# Altium schematic sheet Charger TopLevel.SchDoc
size A3; SheetNumber: 1; SheetTotal: 1; SPICEModelCacheXVHMCBVE: <root> / <DocumentId>XVHMCBVE</DocumentId> / <CacheFrame Number="0"> / <Model Name="dpstrelay" Kind="CKT"> / <Text>*DPST Relay Subcircuit Parameters / *PULLIN     = Pull in voltage / *DROPOFF    = Drop off voltage / *CONTACT    = Contact resistance / *RESISTANCE = Coil resistance / *INDUCTANCE = Coil Inductance / * jjt 15/6/2002: changed DPDT model to DPST. / * / *Generic DPST Relay / *Connections:     NO_A1 / *                 | NO_A2 / *                 | | NO_B1 / *                 | | | NO_B2 / *                 | | | |  T1 / *                 | | | |  | T2 / *                 | | | |  | | / *                 | | | |  | | / *                 | | | |  | | / *                 | | | |  | | / .SUBCKT DPSTRELAY 1 2 3 10 4 5 / + PARAMS: PULLIN=4 DROPOFF=0.1 CONTACT=1m RESISTANCE=500 INDUCTANCE=10m / L1 4 6 {(INDUCTANCE/2)} / L2 5 7 {(INDUCTANCE/2)} / R1 6 7 {RESISTANCE} / * / BNO1 8 0 V={PULLIN}-abs(v(6,7)) / SW1 1 2 8 0 SWNO OFF / * / BNO2 9 0 V={PULLIN}-abs(v(6,7)) / SW2 3 10 9 0 SWNO OFF / * / .MODEL SWNO SW(VT={(PULLIN*0.98)} RON={CONTACT} ) / .ENDS DPSTRELAY</Text> / </Model> / <Model Name="spstrelay" Kind="CKT"> / <Text>*SPST Relay Subcircuit Parameters / *PULLIN     = Pull in voltage / *DROPOFF    = Drop off voltage / *CONTACT    = Contact resistance / *RESISTANCE = Coil resistance / *INDUCTANCE = Coil Inductance / * jjt 15/6/2002: changed DPST model to SPST. / * / *Generic DPST Relay / *Connections:     NO_A1 / *                 | NO_A2 / *                 | | T1 / *                 | | | T2 / *                 | | | | / *                 | | | | / *                 | | | | / *                 | | | | / .SUBCKT SPSTRELAY 1 2 4 5 / + PARAMS: PULLIN=4 DROPOFF=0.1 CONTACT=1m RESISTANCE=500 INDUCTANCE=10m / L1 4 6 {(INDUCTANCE/2)} / L2 5 7 {(INDUCTANCE/2)} / R1 6 7 {RESISTANCE} / * / BNO1 8 0 V={PULLIN}-abs(v(6,7)) / SW1 1 2 8 0 SWNO OFF / * / .MODEL SWNO SW(VT={(PULLIN*0.98)} RON={CONTACT} ) / .ENDS SPSTRELAY</Text> / </Model> / <Model Name="fuse" Kind="CKT"> / <Text>.SUBCKT FUSE 1 2 PARAMS: CURRENT=1 RESISTANCE=1m / SW1 1 2 3 0 SMOD OFF / BNLV 3 0 V=(abs(v(1,2))) / .MODEL SMOD SW (VT={(CURRENT*RESISTANCE)} RON=1g ROFF={RESISTANCE}) / .ENDS FUSE</Text> / </Model> / </CacheFrame> / </root>
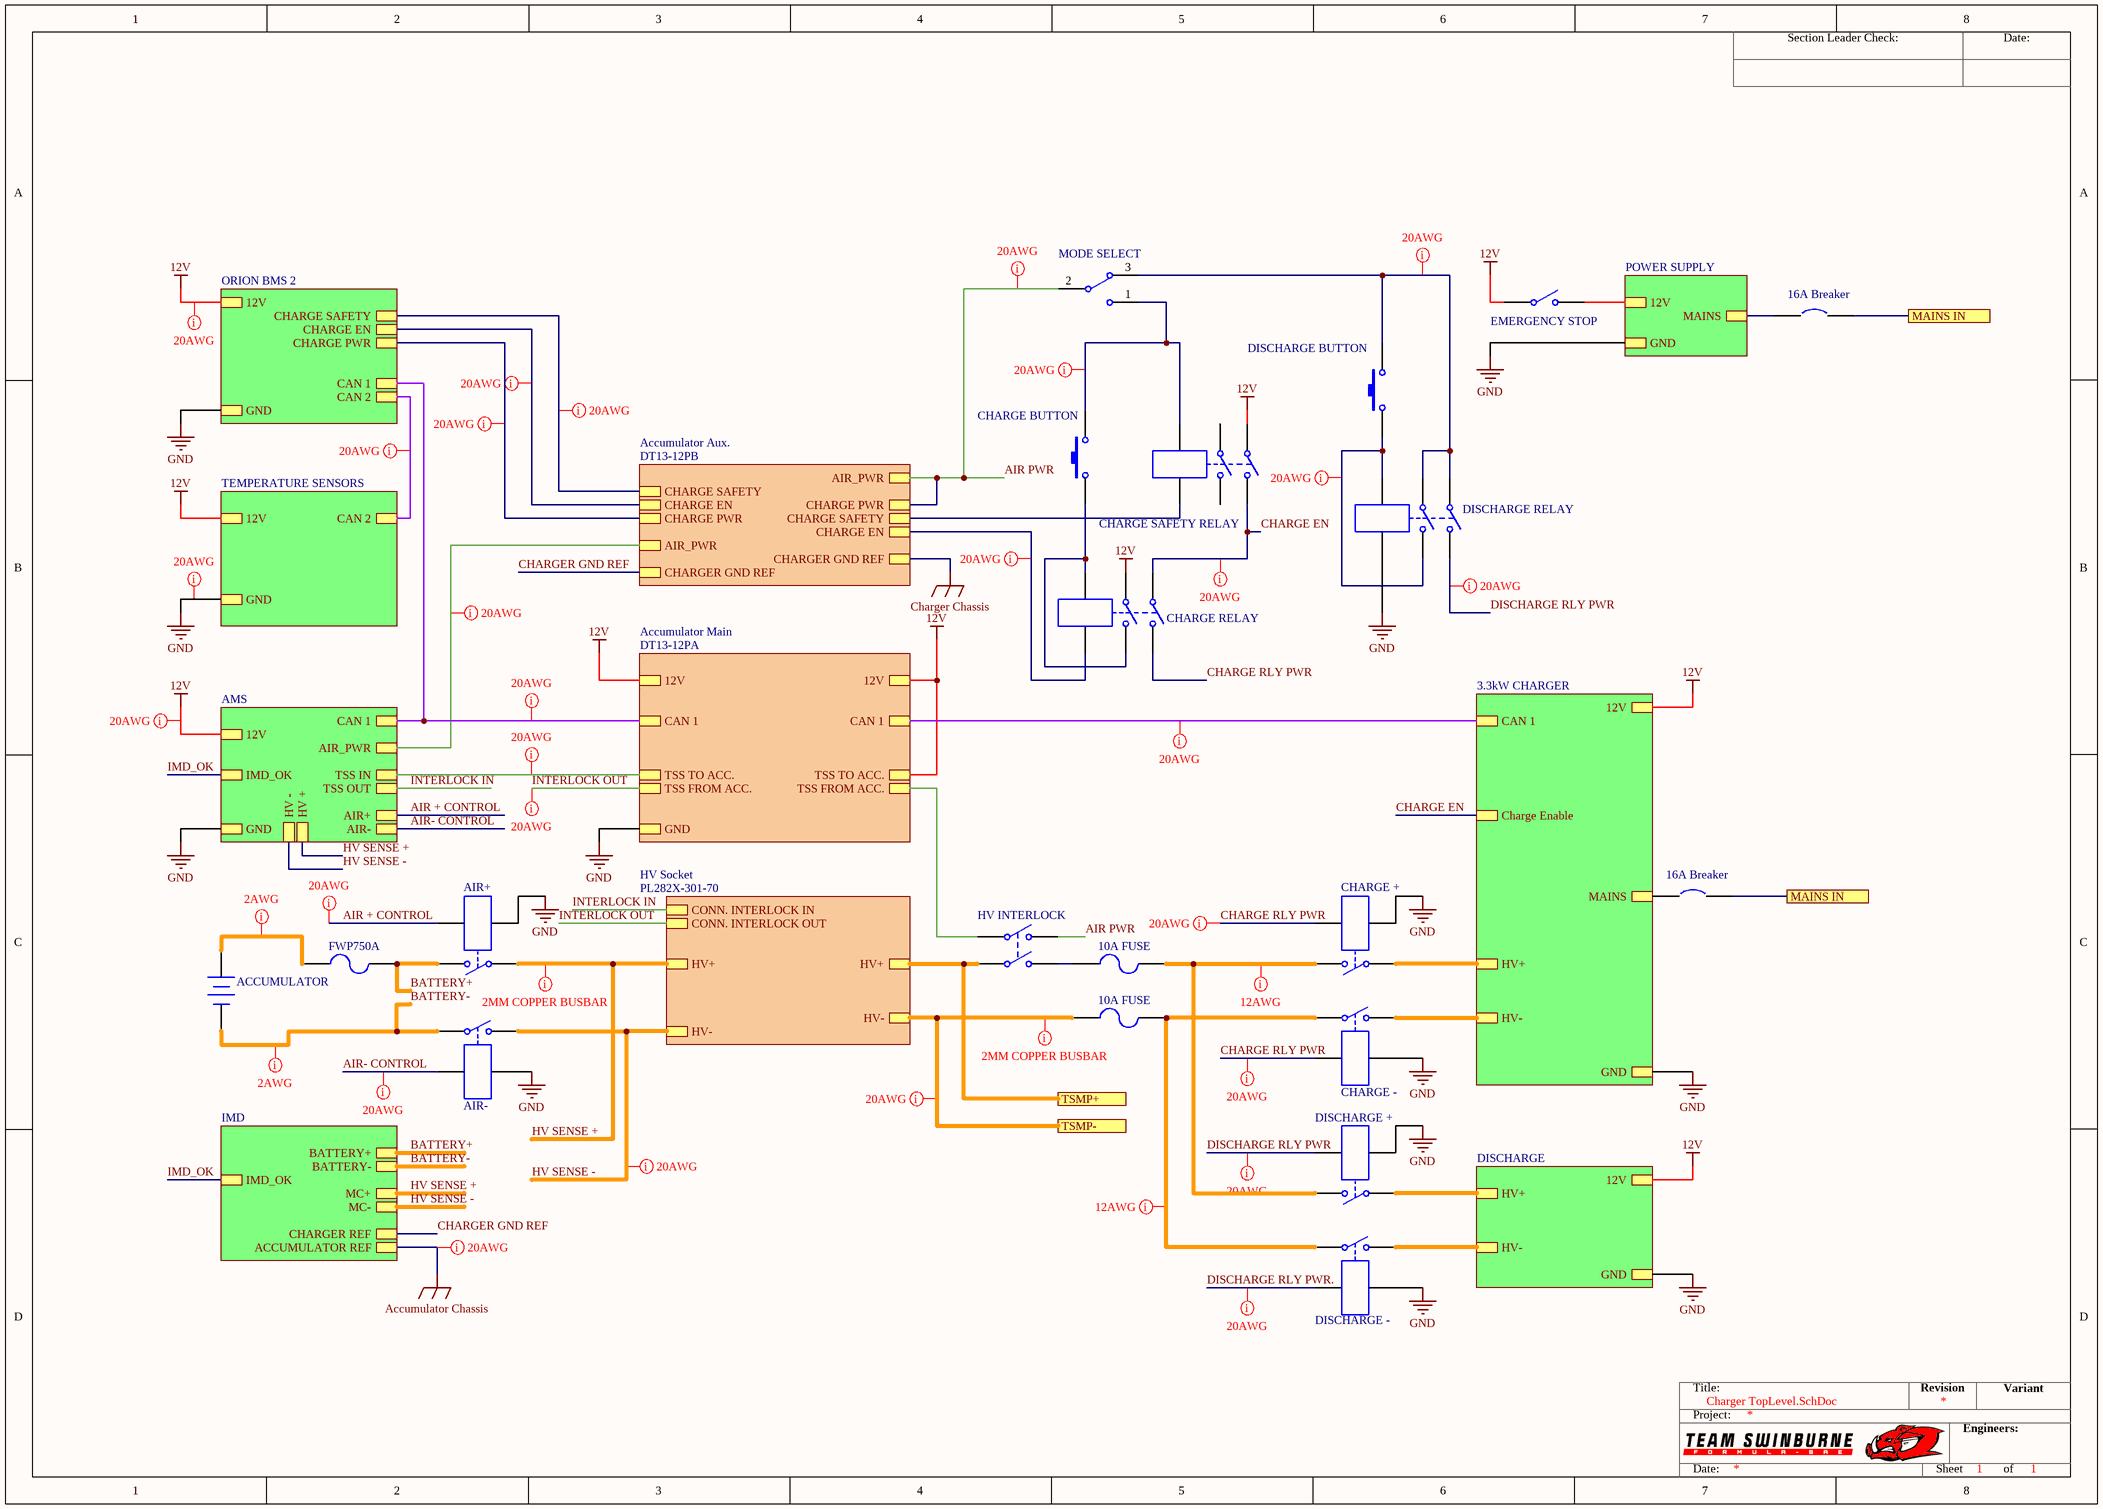
[diagram p0: Charger TopLevel.SchDoc]

## Parts
(Parts that share a designator on the sheet are numbered #1, #2 ... from top to bottom, then left to right.)
10A_FUSE#1  Fuse 2  [PIN-W2/E2.8]  (value not drawn)
10A_FUSE#2  Fuse 2  [PIN-W2/E2.8]  (value not drawn)
16A_Breaker#1  Circuit Breaker  [SPST-2]  (value not drawn)
16A_Breaker#2  Circuit Breaker  [SPST-2]  (value not drawn)
ACCUMULATOR  Battery  [BAT-2]  (value not drawn)
AIR+  Relay-SPST  [MODULE4]  (value not drawn)
AIR-  AIR-  [MODULE4]
CHARGE_+  Relay-SPST  [MODULE4]  (value not drawn)
CHARGE_BUTTON  SW-PB  [SPST-2]  (value not drawn)
CHARGE_RELAY  Relay-DPST  [MODULE6]  (value not drawn)
CHARGE_SAFETY_RELAY  Relay-DPST  [MODULE6]  (value not drawn)
DISCHARGE_+  Relay-SPST  [MODULE4]  (value not drawn)
DISCHARGE_BUTTON  SW-PB  [SPST-2]  (value not drawn)
DISCHARGE_RELAY  Relay-DPST  [MODULE6]  (value not drawn)
EMERGENCY_STOP  SW-SPST  [SPST-2]  (value not drawn)
FWP750A  Fuse 2  [PIN-W2/E2.8]  (value not drawn)
HV_INTERLOCK  SW-DPST  [DPST-4]  (value not drawn)
K?#1  CHARGE -  [MODULE4]
K?#2  DISCHARGE -  [MODULE4]
MODE_SELECT  (no value)  [TL36WW15050]

## Sub-sheets
3.3kW CHARGER = File Name: CAN 1, GND, 12V, HV+, HV-, MAINS, Charge Enable
Accumulator Aux. = DT13-12PB: CHARGE SAFETY, CHARGE EN, CHARGE PWR, AIR_PWR, AIR_PWR, CHARGE SAFETY, CHARGE EN, CHARGE PWR, CHARGER GND REF, CHARGER GND REF
Accumulator Main = DT13-12PA: 12V, GND, CAN 1, TSS TO ACC., TSS FROM ACC., TSS TO ACC., TSS FROM ACC., 12V, CAN 1
AMS = File Name: CAN 1, GND, 12V, HV +, HV -, TSS IN, TSS OUT, AIR_PWR, AIR+, AIR-, IMD_OK
DISCHARGE = File Name: HV+, GND, 12V, HV-
HV Socket = PL282X-301-70: HV+, HV-, HV+, HV-, CONN. INTERLOCK IN, CONN. INTERLOCK OUT
IMD = File Name: BATTERY+, BATTERY-, IMD_OK, CHARGER REF, ACCUMULATOR REF, MC+, MC-
ORION BMS 2 = File Name: 12V, GND, CHARGE PWR, CHARGE SAFETY, CHARGE EN, CAN 1, CAN 2
POWER SUPPLY = File Name: 12V, GND, MAINS
TEMPERATURE SENSORS = File Name: CAN 2, GND, 12V

## Ports
MAINS IN, TSMP+, TSMP-

## Nets
12V: CHARGE_RELAY.3 CHARGE_SAFETY_RELAY.1 EMERGENCY_STOP.1(COMMON) ; sheet ORION BMS 2/12V, sheet TEMPERATURE SENSORS/12V, sheet AMS/12V, sheet Accumulator Main/12V, sheet Accumulator Main/TSS TO ACC., sheet Accumulator Main/12V, sheet 3.3kW CHARGER/12V, sheet DISCHARGE/12V
Accumulator Chassis: sheet IMD/ACCUMULATOR REF
Charger Chassis: sheet Accumulator Aux./CHARGER GND REF
GND: AIR+.3 AIR-.4 CHARGE_+.3 DISCHARGE_+.3 DISCHARGE_RELAY.6 K?#1.4 K?#2.4 ; sheet ORION BMS 2/GND, sheet TEMPERATURE SENSORS/GND, sheet AMS/GND, sheet Accumulator Main/GND, sheet POWER SUPPLY/GND, sheet 3.3kW CHARGER/GND, sheet DISCHARGE/GND
AIR + CONTROL: AIR+.4 ; sheet AMS/AIR+
AIR PWR: HV_INTERLOCK.2(NO1) MODE_SELECT.2 ; sheet Accumulator Aux./AIR_PWR, sheet Accumulator Aux./CHARGE PWR
AIR- CONTROL: AIR-.3 ; sheet AMS/AIR-
BATTERY+: AIR+.2 FWP750A.2 ; sheet IMD/BATTERY+
BATTERY-: ACCUMULATOR.2(-) AIR-.1 ; sheet IMD/BATTERY-
CHARGE EN: CHARGE_RELAY.1 CHARGE_SAFETY_RELAY.2 ; sheet 3.3kW CHARGER/Charge Enable
CHARGE RLY PWR: CHARGE_+.4 CHARGE_RELAY.2 K?#1.3
CHARGER GND REF: sheet Accumulator Aux./CHARGER GND REF, sheet IMD/CHARGER REF
DISCHARGE RLY PWR: DISCHARGE_+.4 DISCHARGE_RELAY.2
DISCHARGE RLY PWR.: K?#2.3
HV SENSE +: AIR+.1 ; sheet AMS/HV +, sheet HV Socket/HV+, sheet IMD/MC+
HV SENSE -: AIR-.2 ; sheet AMS/HV -, sheet HV Socket/HV-, sheet IMD/MC-
IMD_OK: sheet AMS/IMD_OK, sheet IMD/IMD_OK
INTERLOCK IN: sheet AMS/TSS OUT, sheet HV Socket/CONN. INTERLOCK IN
INTERLOCK OUT: sheet Accumulator Main/TSS FROM ACC., sheet HV Socket/CONN. INTERLOCK OUT
MAINS IN: 16A_Breaker#1.2 16A_Breaker#2.2 ; port MAINS IN
TSMP+: HV_INTERLOCK.3(COMMON2) ; port TSMP+, sheet HV Socket/HV+
TSMP-: 10A_FUSE#2.1 ; port TSMP-, sheet HV Socket/HV-
Net10A_FUSE#1_1: 10A_FUSE#1.1 HV_INTERLOCK.4(NO2)
Net10A_FUSE#1_2: 10A_FUSE#1.2 CHARGE_+.2 DISCHARGE_+.2
Net10A_FUSE#2_2: 10A_FUSE#2.2 K?#1.1 K?#2.1
Net16A_Breaker#1_1: 16A_Breaker#1.1 ; sheet POWER SUPPLY/MAINS
Net16A_Breaker#2_1: 16A_Breaker#2.1 ; sheet 3.3kW CHARGER/MAINS
NetACCUMULATOR_1: ACCUMULATOR.1(+) FWP750A.1
NetCHARGE_+_1: CHARGE_+.1 ; sheet 3.3kW CHARGER/HV+
NetCHARGE_BUTTON_1: CHARGE_BUTTON.1 CHARGE_RELAY.4 CHARGE_RELAY.5
NetCHARGE_BUTTON_2: CHARGE_BUTTON.2 CHARGE_SAFETY_RELAY.5 MODE_SELECT.1
NetCHARGE_RELAY_6: CHARGE_RELAY.6 ; sheet Accumulator Aux./CHARGE EN
NetCHARGE_SAFETY_RELAY_6: CHARGE_SAFETY_RELAY.6 ; sheet Accumulator Aux./CHARGE SAFETY
NetDISCHARGE_+_1: DISCHARGE_+.1 ; sheet DISCHARGE/HV+
NetDISCHARGE_BUTTON_1: DISCHARGE_BUTTON.1 DISCHARGE_RELAY.4 DISCHARGE_RELAY.5
NetDISCHARGE_BUTTON_2: DISCHARGE_BUTTON.2 DISCHARGE_RELAY.1 DISCHARGE_RELAY.3 MODE_SELECT.3
NetEMERGENCY_STOP_2: EMERGENCY_STOP.2(NO) ; sheet POWER SUPPLY/12V
NetHV_INTERLOCK_1: HV_INTERLOCK.1(COMMON1) ; sheet Accumulator Main/TSS FROM ACC.
NetK?#1_2: K?#1.2 ; sheet 3.3kW CHARGER/HV-
NetK?#2_2: K?#2.2 ; sheet DISCHARGE/HV-
(unnamed): sheet ORION BMS 2/CHARGE PWR, sheet Accumulator Aux./CHARGE PWR
(unnamed): sheet ORION BMS 2/CHARGE SAFETY, sheet Accumulator Aux./CHARGE SAFETY
(unnamed): sheet ORION BMS 2/CHARGE EN, sheet Accumulator Aux./CHARGE EN
(unnamed): sheet ORION BMS 2/CAN 1, sheet AMS/CAN 1, sheet Accumulator Main/CAN 1
(unnamed): sheet ORION BMS 2/CAN 2, sheet TEMPERATURE SENSORS/CAN 2
(unnamed): sheet AMS/TSS IN, sheet Accumulator Main/TSS TO ACC.
(unnamed): sheet AMS/AIR_PWR, sheet Accumulator Aux./AIR_PWR
(unnamed): sheet Accumulator Main/CAN 1, sheet 3.3kW CHARGER/CAN 1

Not connected (* = marked no-connect by the designer): CHARGE_SAFETY_RELAY 3 4

## Layout directives
mark named 20AWG: 12V, (no net found under the mark), Accumulator Chassis, AIR + CONTROL, AIR PWR, AIR- CONTROL, CHARGE EN, CHARGE RLY PWR, DISCHARGE RLY PWR, DISCHARGE RLY PWR., GND, HV SENSE -, INTERLOCK OUT, NetCHARGE_BUTTON_2, NetCHARGE_RELAY_6, NetDISCHARGE_BUTTON_1, NetDISCHARGE_BUTTON_2, TSMP-
mark named 12AWG: Net10A_FUSE#1_2, Net10A_FUSE#2_2
mark named 2MM COPPER BUSBAR: HV SENSE +, TSMP-
mark named 2AWG: BATTERY-, NetACCUMULATOR_1

## Notes on the sheet
- Section Leader Check:
- Date:
- Title:
- Revision
- Variant
- Project:
- Engineers:
- Sheet
- of

## Library data of the parts
10A_FUSE#1 10A_FUSE#2 FWP750A = Fuse 2: Fuse; Published: 8-Jun-2000; LatestRevisionDate: 17-Jul-2002; LatestRevisionNote: Re-released for DXP Platform.; PackageReference: PIN-W2/E2.8; Publisher: Altium Limited; PackageDescription: Thru-Hole; 2 Leads
ACCUMULATOR = Battery: Multicell Battery; Published: 24-Mar-1999; LatestRevisionDate: 17-Jul-2002; LatestRevisionNote: Re-released for DXP Platform.; PackageReference: BAT-2; Publisher: Altium Limited; PackageDescription: Battery; 2 Leads
AIR+ AIR- CHARGE_+ DISCHARGE_+ K?#1 K?#2 = Relay-SPST: Single-Pole Single-Throw Relay; Published: 24-Mar-1999; LatestRevisionDate: 17-Jul-2002; LatestRevisionNote: Re-released for DXP Platform.; PackageReference: MODULE4; Publisher: Altium Limited
CHARGE_BUTTON DISCHARGE_BUTTON = SW-PB: Switch; Published: 24-Mar-1999; LatestRevisionDate: 17-Jul-2002; LatestRevisionNote: Re-released for DXP Platform.; PackageReference: SPST-2; Publisher: Altium Limited; PackageDescription: Switch; 2 Leads
CHARGE_RELAY CHARGE_SAFETY_RELAY DISCHARGE_RELAY = Relay-DPST: Dual-Pole Single-Throw Relay; Published: 24-Mar-1999; LatestRevisionDate: 17-Jul-2002; LatestRevisionNote: Re-released for DXP Platform.; PackageReference: MODULE6; Publisher: Altium Limited
EMERGENCY_STOP = SW-SPST: Single-Pole, Single-Throw Switch; Published: 24-Mar-1999; LatestRevisionDate: 17-Jul-2002; LatestRevisionNote: Re-released for DXP Platform.; PackageReference: SPST-2; Publisher: Altium Limited; PackageDescription: Switch; 2 Leads
HV_INTERLOCK = SW-DPST: Double-Pole, Single-Throw Switch; Published: 24-Mar-1999; LatestRevisionDate: 17-Jul-2002; LatestRevisionNote: Re-released for DXP Platform.; PackageReference: DPST-4; Publisher: Altium Limited; PackageDescription: Switch; 4 Leads
MODE_SELECT = SW-SPDT: SPDT Subminiature Toggle Switch, Right Angle Mounting, Vertical Actuation; Published: 24-Mar-1999; LatestRevisionDate: 17-Dec-2003; LatestRevisionNote: Schematic revised, PCB Footprint replaced.; DatasheetVersion: 05-Dec-2000; PackageReference: TL36WW15050; Publisher: Altium Limited; PackageDescription: Switch; 4 Leads; ComponentLink1Description: Manufacturer Link; ComponentLink1URL: http://www.apem.com
16A_Breaker#1 16A_Breaker#2 = Circuit Breaker: Published: 24-Mar-1999; LatestRevisionDate: 17-Jul-2002; LatestRevisionNote: Re-released for DXP Platform.; PackageReference: SPST-2; Publisher: Altium Limited; PackageDescription: Switch; 2 Leads